# Altium schematic sheet CL31A107MQHNNNE1_CL31A107MQHNNNE.schdoc
size 124 x 101 mm
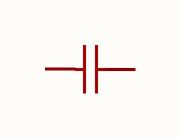
[diagram p0: CL31A107MQHNNNE1_CL31A107MQHNNNE.schdoc]

## Parts
C?  100uF  [C1206]  (value not drawn)

## Nets

Not connected (* = marked no-connect by the designer): C? 1 2

## Library data of the parts
C? = CL31A107MQHNNNE: Manufacturer: SAMSUNG(三星); Add into BOM: yes; Tolerance: ±20%; Voltage Rating: 6.3V; Temperature Coefficient: X5R; Symbol: CL31A107MQHNNNE; Device: CL31A107MQHNNNE; LCSC Part Name: 100uF ±20% 6.3V; Supplier Part: C15008; Manufacturer Part: CL31A107MQHNNNE; Supplier Footprint: 1206; JLCPCB Part Class: Basic Part; Datasheet: https://item.szlcsc.com/datasheet/CL31A107MQHNNNE/15681.html; Supplier: LCSC; Convert to PCB: yes; Value: 100uF